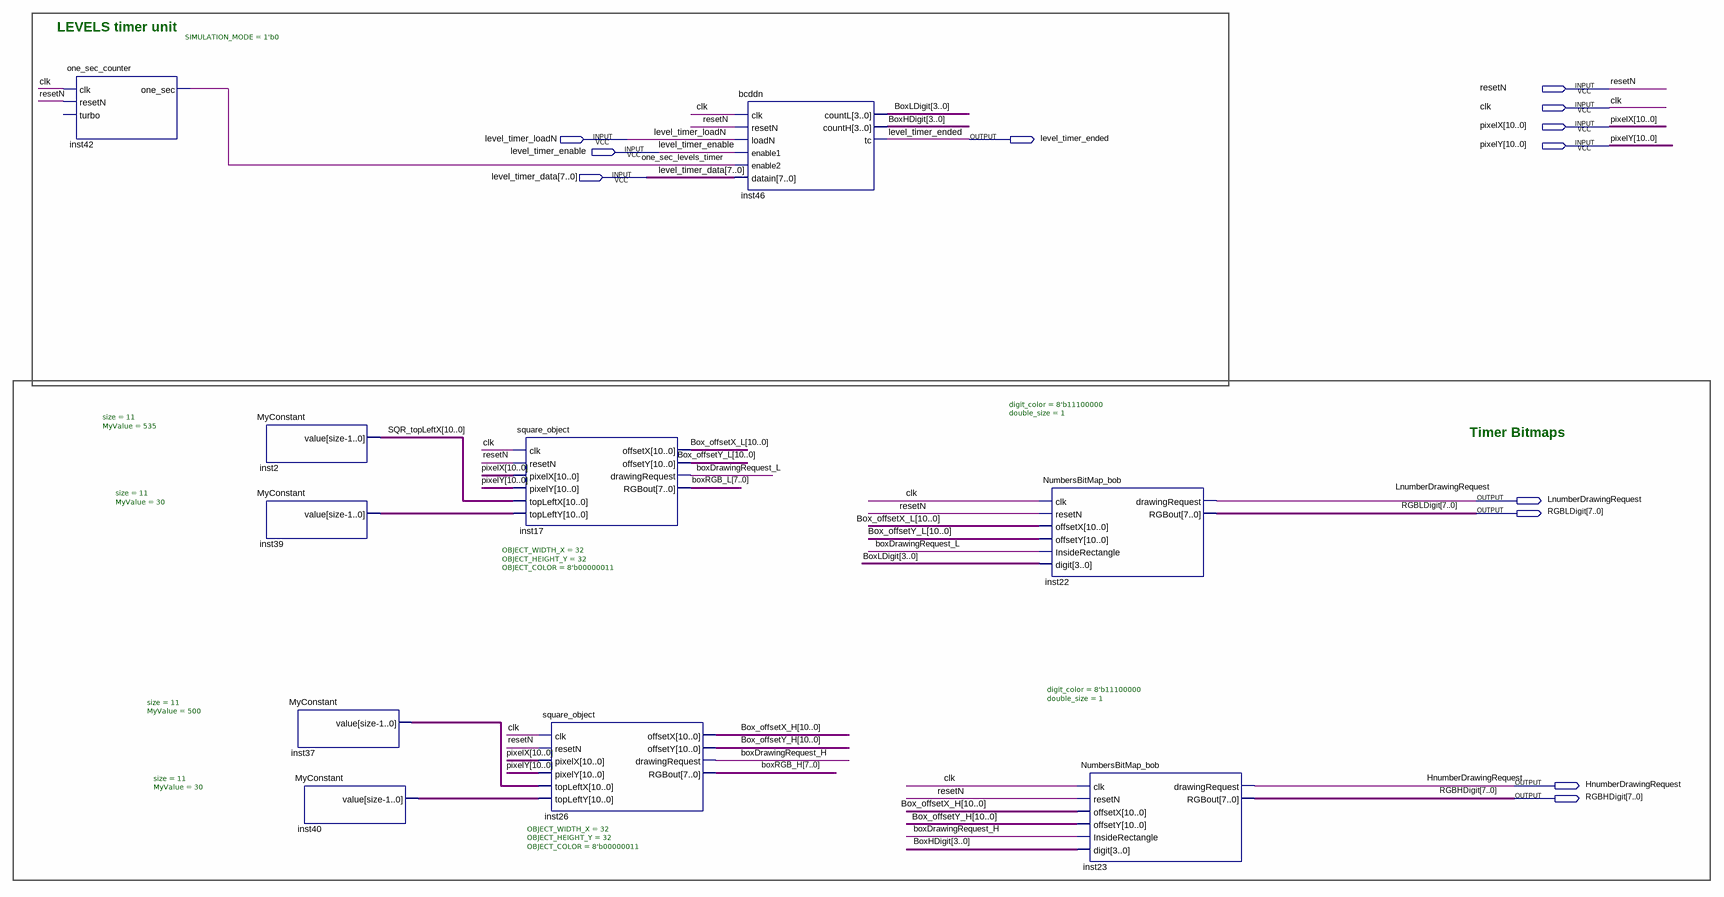
[diagram p0: schematic sheet]
// Quartus schematic levels_timer.bdf as structural Verilog: 10 symbols, 12 pins
module levels_timer (
  input  resetN,
  input  clk,
  input  [10:0] pixelX,
  input  level_timer_loadN,
  input  [10:0] pixelY,
  input  level_timer_enable,
  input  [7:0] level_timer_data,
  output level_timer_ended,
  output LnumberDrawingRequest,
  output [7:0] RGBLDigit,
  output HnumberDrawingRequest,
  output [7:0] RGBHDigit
);

  wire boxDrawingRequest_H, boxDrawingRequest_L, one_sec_levels_timer;
  wire [3:0] BoxHDigit, BoxLDigit;
  wire [7:0] boxRGB_H, boxRGB_L;
  wire [10:0] Box_offsetX_H, Box_offsetX_L, Box_offsetY_H, Box_offsetY_L, inst37_value, inst39_value,
       inst40_value, SQR_topLeftX;

  one_sec_counter #(.SIMULATION_MODE(1'b0)) inst42 (
    .clk(clk), .resetN(resetN), .one_sec(one_sec_levels_timer));  // open: turbo
  MyConstant #(.size(11), .MyValue(535)) inst2 (.value(SQR_topLeftX));
  MyConstant #(.size(11), .MyValue(30)) inst39 (.value(inst39_value));
  MyConstant #(.size(11), .MyValue(500)) inst37 (.value(inst37_value));
  MyConstant #(.size(11), .MyValue(30)) inst40 (.value(inst40_value));
  square_object #(.OBJECT_WIDTH_X(32), .OBJECT_HEIGHT_Y(32), .OBJECT_COLOR(8'b00000011)) inst17 (
    .clk(clk), .resetN(resetN), .pixelX(pixelX), .pixelY(pixelY), .topLeftX(SQR_topLeftX),
    .topLeftY(inst39_value), .offsetX(Box_offsetX_L), .offsetY(Box_offsetY_L),
    .drawingRequest(boxDrawingRequest_L), .RGBout(boxRGB_L));
  square_object #(.OBJECT_WIDTH_X(32), .OBJECT_HEIGHT_Y(32), .OBJECT_COLOR(8'b00000011)) inst26 (
    .clk(clk), .resetN(resetN), .pixelX(pixelX), .pixelY(pixelY), .topLeftX(inst37_value),
    .topLeftY(inst40_value), .offsetX(Box_offsetX_H), .offsetY(Box_offsetY_H),
    .drawingRequest(boxDrawingRequest_H), .RGBout(boxRGB_H));
  bcddn inst46 (
    .clk(clk), .resetN(resetN), .loadN(level_timer_loadN), .enable1(level_timer_enable),
    .enable2(one_sec_levels_timer), .datain(level_timer_data), .countL(BoxLDigit), .countH(BoxHDigit),
    .tc(level_timer_ended));
  NumbersBitMap_bob #(.digit_color(8'b11100000), .double_size(1)) inst22 (
    .clk(clk), .resetN(resetN), .offsetX(Box_offsetX_L), .offsetY(Box_offsetY_L),
    .InsideRectangle(boxDrawingRequest_L), .digit(BoxLDigit), .drawingRequest(LnumberDrawingRequest),
    .RGBout(RGBLDigit));
  NumbersBitMap_bob #(.digit_color(8'b11100000), .double_size(1)) inst23 (
    .clk(clk), .resetN(resetN), .offsetX(Box_offsetX_H), .offsetY(Box_offsetY_H),
    .InsideRectangle(boxDrawingRequest_H), .digit(BoxHDigit), .drawingRequest(HnumberDrawingRequest),
    .RGBout(RGBHDigit));

  // Notes on the sheet:
  //   LEVELS timer unit
  //   Timer Bitmaps
endmodule
